# EAGLE schematic ASM2001 (EAGLE 6.3)
DATABASE: ./../../../../../Components/TinyCircuits_Part_Database.txt
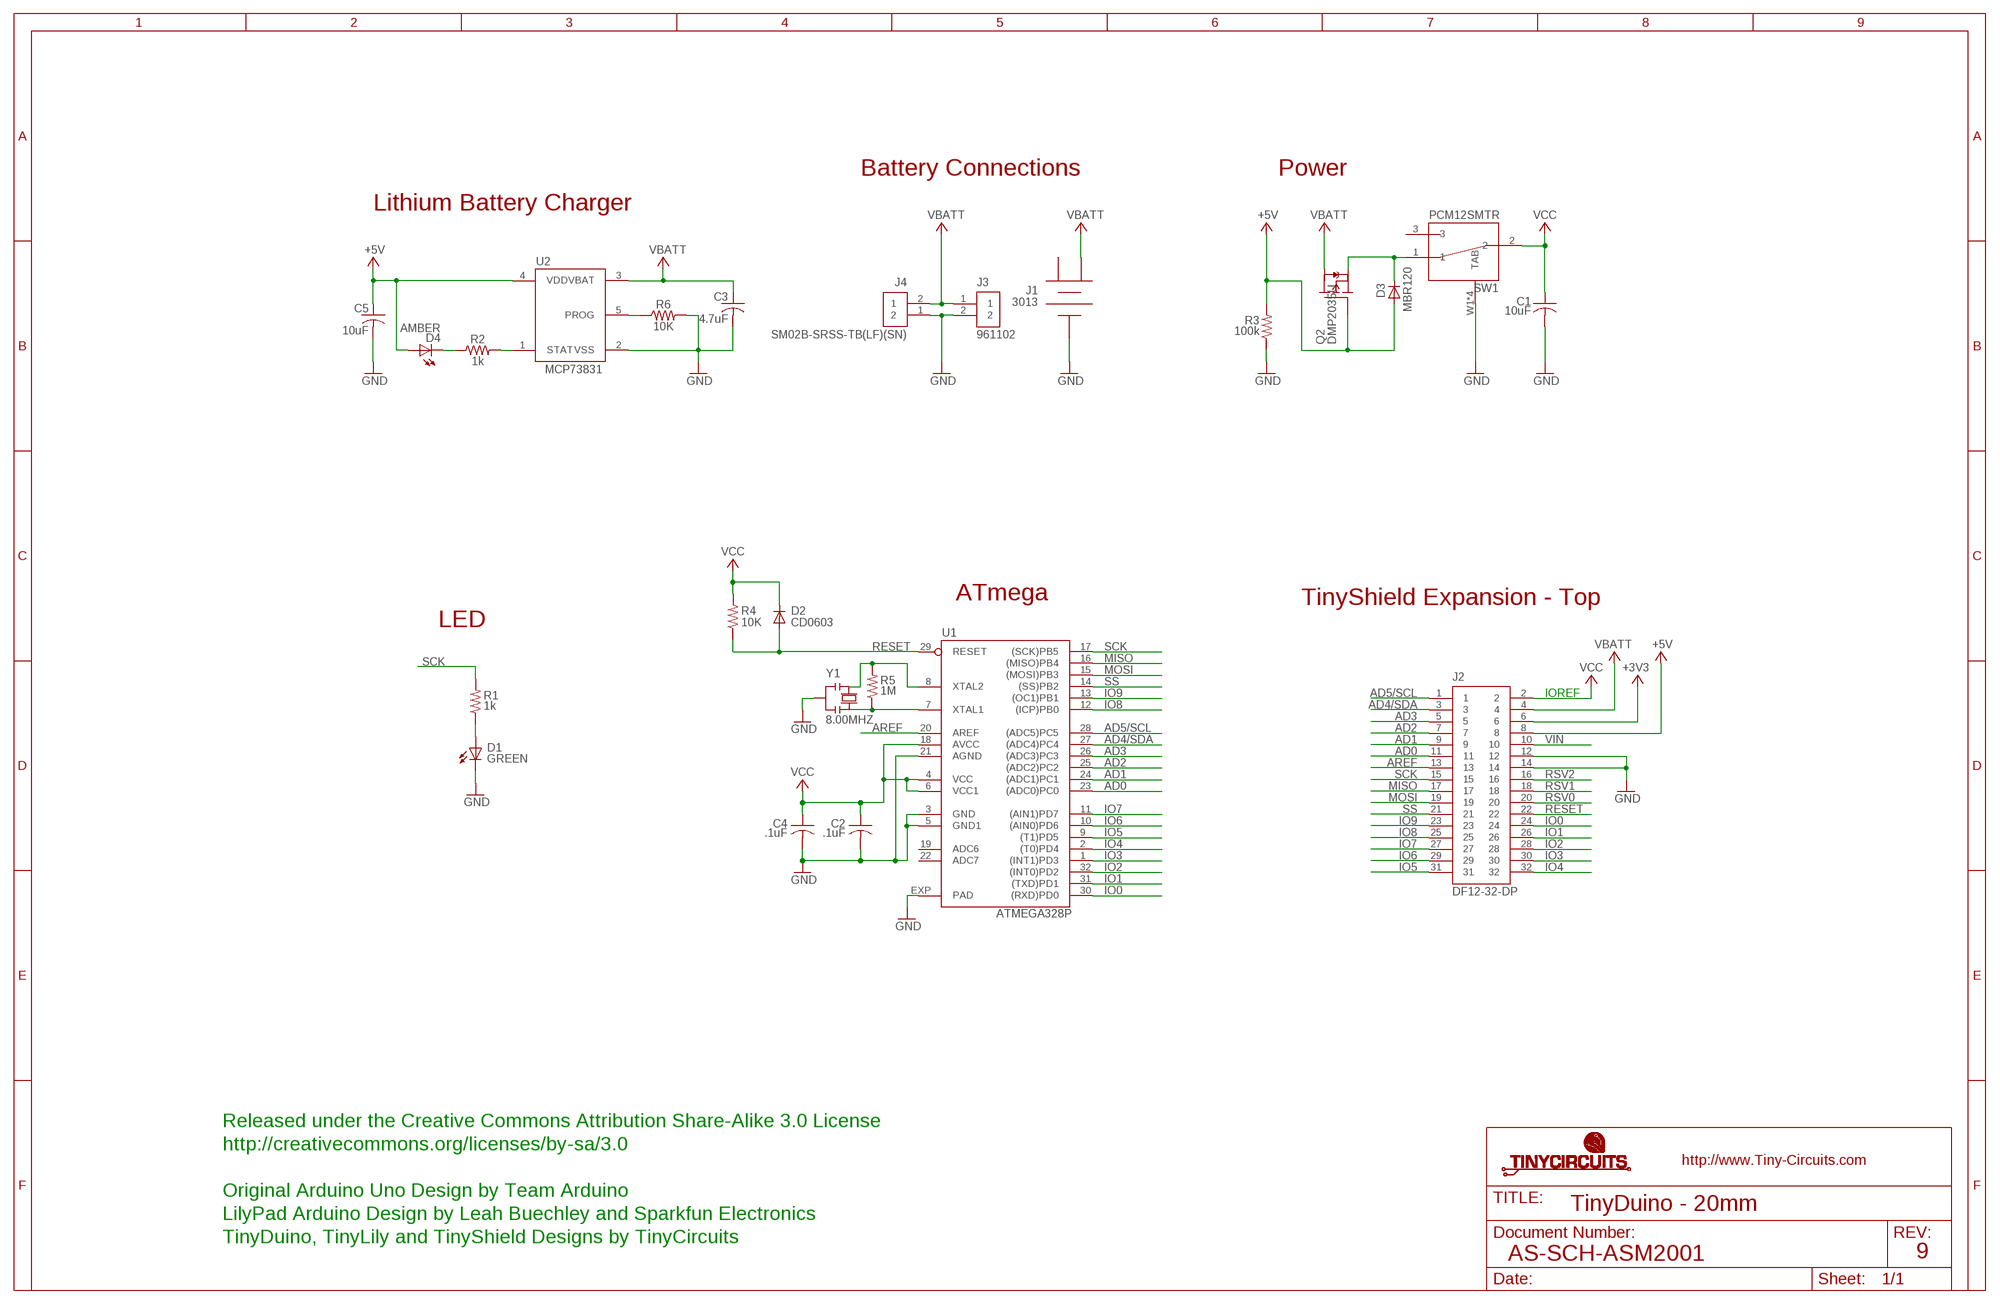
[diagram p0: schematic, sheet 1]

## Parts
C1  10uF  AS-ITM-00002  [C0603]
C2  .1uF  AS-ITM-00008  [C0402]
C3  4.7uF  AS-ITM-00242  [C0402]
C4  .1uF  AS-ITM-00008  [C0402]
C5  10uF  AS-ITM-00002  [C0603]
D1  GREEN  AS-ITM-00011  [LNJ_LED]
D2  CD0603  AS-ITM-00009  [0603]
D3  MBR120  AS-ITM-00111  [SOD-123FL]
D4  AMBER  AS-ITM-00026  [LNJ_LED]
J1  3013  AS-ITM-00001  [3013]
J2  DF12-32-DP  AS-ITM-00015  [DF12-32-DP]
J3  961102  AS-ITM-00044  [2X.1"]
J4  SM02B-SRSS-TB(LF)(SN)  AS-ITM-00231  [JST_SH_2X1]
Q2  DMP2035U  AS-ITM-00024  [SOT23]
R1  1k  AS-ITM-00003  [0402]
R2  1k  AS-ITM-00003  [0402]
R3  100k  AS-ITM-00004  [0402]
R4  10K  AS-ITM-00032  [0402]
R5  1M  AS-ITM-00005  [0402]
R6  10K  AS-ITM-00032  [0402]
SW1  PCM12SMTR  AS-ITM-00220  [PCM12SMTR]
U1  ATMEGA328P  AS-ITM-00013MU  [ATMEL_QFN32]
U2  MCP73831  AS-ITM-00136  [SOT-23]
Y1  8.00MHZ  AS-ITM-00027B  [RESONATOR_SMALL]

## Nets
+3V3: J2.6
+5V: C5.1 D3.A D4.A J2.8 Q2.B(G) R3.2 U2.4(VDD)
AD0: J2.11 U1.23((ADC0)PC0)
AD1: J2.9 U1.24((ADC1)PC1)
AD2: J2.7 U1.25((ADC2)PC2)
AD3: J2.5 U1.26((ADC3)PC3)
AD4/SDA: J2.3 U1.27((ADC4)PC4)
AD5/SCL: J2.1 U1.28((ADC5)PC5)
AREF: J2.13 U1.20(AREF)
GND: C1.2 C2.2 C3.2 C4.2 C5.2 D1.C J1.3 J2.12 J2.14 J3.2 J4.1 R3.1 R6.2 SW1.W1(TAB) SW1.W2(TAB) SW1.W3(TAB) SW1.W4(TAB) U1.3(GND) U1.5(GND1) U1.21(AGND) U1.EXP(PAD) U2.2(VSS) Y1.2
IO0: J2.24 U1.30((RXD)PD0)
IO1: J2.26 U1.31((TXD)PD1)
IO2: J2.28 U1.32((INT0)PD2)
IO3: J2.30 U1.1((INT1)PD3)
IO4: J2.32 U1.2((T0)PD4)
IO5: J2.31 U1.9((T1)PD5)
IO6: J2.29 U1.10((AIN0)PD6)
IO7: J2.27 U1.11((AIN1)PD7)
IO8: J2.25 U1.12((ICP)PB0)
IO9: J2.23 U1.13((OC1)PB1)
MISO: J2.17 U1.16((MISO)PB4)
MOSI: J2.19 U1.15((MOSI)PB3)
N$1: R5.2 U1.8(XTAL2) Y1.1
N$2: D3.C Q2.E(S) SW1.1
N$3: R5.1 U1.7(XTAL1) Y1.3
N$4: D1.A R1.1
N$5: D4.C R2.1
N$6: R6.1 U2.5(PROG)
N$7: R2.2 U2.1(STAT)
RESET: D2.A J2.22 R4.1 U1.29(RESET)
RSV0: J2.20
RSV1: J2.18
RSV2: J2.16
SCK: J2.15 R1.2 U1.17((SCK)PB5)
SS: J2.21 U1.14((SS)PB2)
VBATT: C3.1 J1.2 J2.4 J3.1 J4.2 Q2.C(D) U2.3(VBAT)
VCC: C1.1 C2.1 C4.1 D2.C J2.2 R4.2 SW1.2 U1.4(VCC) U1.6(VCC1) U1.18(AVCC)
VIN: J2.10
Unconnected: SW1.3 U1.19(ADC6) U1.22(ADC7)

## Notes on the sheet
- Battery Connections | Power
- Lithium Battery Charger
- ATmega | TinyShield Expansion - Top
- LED
- IOREF
- Released under the Creative Commons Attribution Share-Alike 3.0 License
- http://creativecommons.org/licenses/by-sa/3.0
- Original Arduino Uno Design by Team Arduino
- TinyDuino - 20mm
- LilyPad Arduino Design by Leah Buechley and Sparkfun Electronics
- TinyDuino, TinyLily and TinyShield Designs by TinyCircuits
- AS-SCH-ASM2001 | 9

## Power pins joined to a net without a drawn wire
1: J1.1

## Library data of the parts
C1 C5 = tinycircuits:AS-ITM-00002: CAP CER 10UF 10V 20% X5R 0603; PARTNO: AS-ITM-00002
C2 C4 = tinycircuits:AS-ITM-00008: CAP CER 0.1UF 16V 10% X5R 0402; PARTNO: AS-ITM-00008; VALUE: 0.1uF
C3 = tinycircuits:AS-ITM-00242: CAP CER 4.7UF 6.3V 20% X5R 0402; PARTNO: AS-ITM-00242
D1 = tinycircuits:AS-ITM-00011: LED GREEN SIDE VIEW SMD; PARTNO: AS-ITM-00011
D2 = tinycircuits:AS-ITM-00009: Diodes (General Purpose, Power, Switching) IO=150mA VR=75V HIGH SPEED; PARTNO: AS-ITM-00009
D3 = tinycircuits:AS-ITM-00111: DIODE SCHOTTKY 20V 1A SOD123L; PARTNO: AS-ITM-00111; VALUE: MBR120VLSFT1G
D4 = tinycircuits:AS-ITM-00026: LED AMBER SIDE VIEW SMD; PARTNO: AS-ITM-00026
J1 = tinycircuits:AS-ITM-00001: Keystone 3013 - RETAINER COIN CELL 16MM PC T/H; PARTNO: AS-ITM-00001
J2 = tinycircuits:AS-ITM-00015: CONN HEADER 32POS 3MM SMD 0.5MM; PARTNO: AS-ITM-00015
J3 = tinycircuits:AS-ITM-00044: CONN HEADER R/A SGL 2POS GOLD; PARTNO: AS-ITM-00044
J4 = tinycircuits:AS-ITM-00231: CONN HEADER SH 2POS SIDE 1MM; PARTNO: AS-ITM-00231
Q2 = tinycircuits:AS-ITM-00024: P-Channel MOSFET SOT-23; PARTNO: AS-ITM-00024
R1 R2 = tinycircuits:AS-ITM-00003: RES 1.00K OHM 1/16W 1% 0402; PARTNO: AS-ITM-00003; VALUE: 1.00K
R3 = tinycircuits:AS-ITM-00004: RES 100K OHM 1/16W 1% 0402; PARTNO: AS-ITM-00004; VALUE: 100K
R4 R6 = tinycircuits:AS-ITM-00032: RES 10.0K OHM 1/16W 1% 0402 SMD; PARTNO: AS-ITM-00032; VALUE: 10.0K
R5 = tinycircuits:AS-ITM-00005: RES 1.00M OHM 1/16W 1% 0402; PARTNO: AS-ITM-00005; VALUE: 1.00M
SW1 = tinycircuits:AS-ITM-00220: SW SLIDE SP2T 6VDC 0.3A SMT; PARTNO: AS-ITM-00220
U1 = tinycircuits:AS-ITM-00013: MCU AVR 32K FLASH 32-QFN; PARTNO: AS-ITM-00013; VALUE: ATMEGA328P-MU
U2 = tinycircuits:AS-ITM-00136: IC CONTROLLER LI-ION 4.2V SOT23-5; PARTNO: AS-ITM-00136
Y1 = tinycircuits:AS-ITM-00027: CER RESONATOR 8.00MHZ SMD; PARTNO: AS-ITM-00027